# EAGLE design aspirin (EAGLE 6.4)
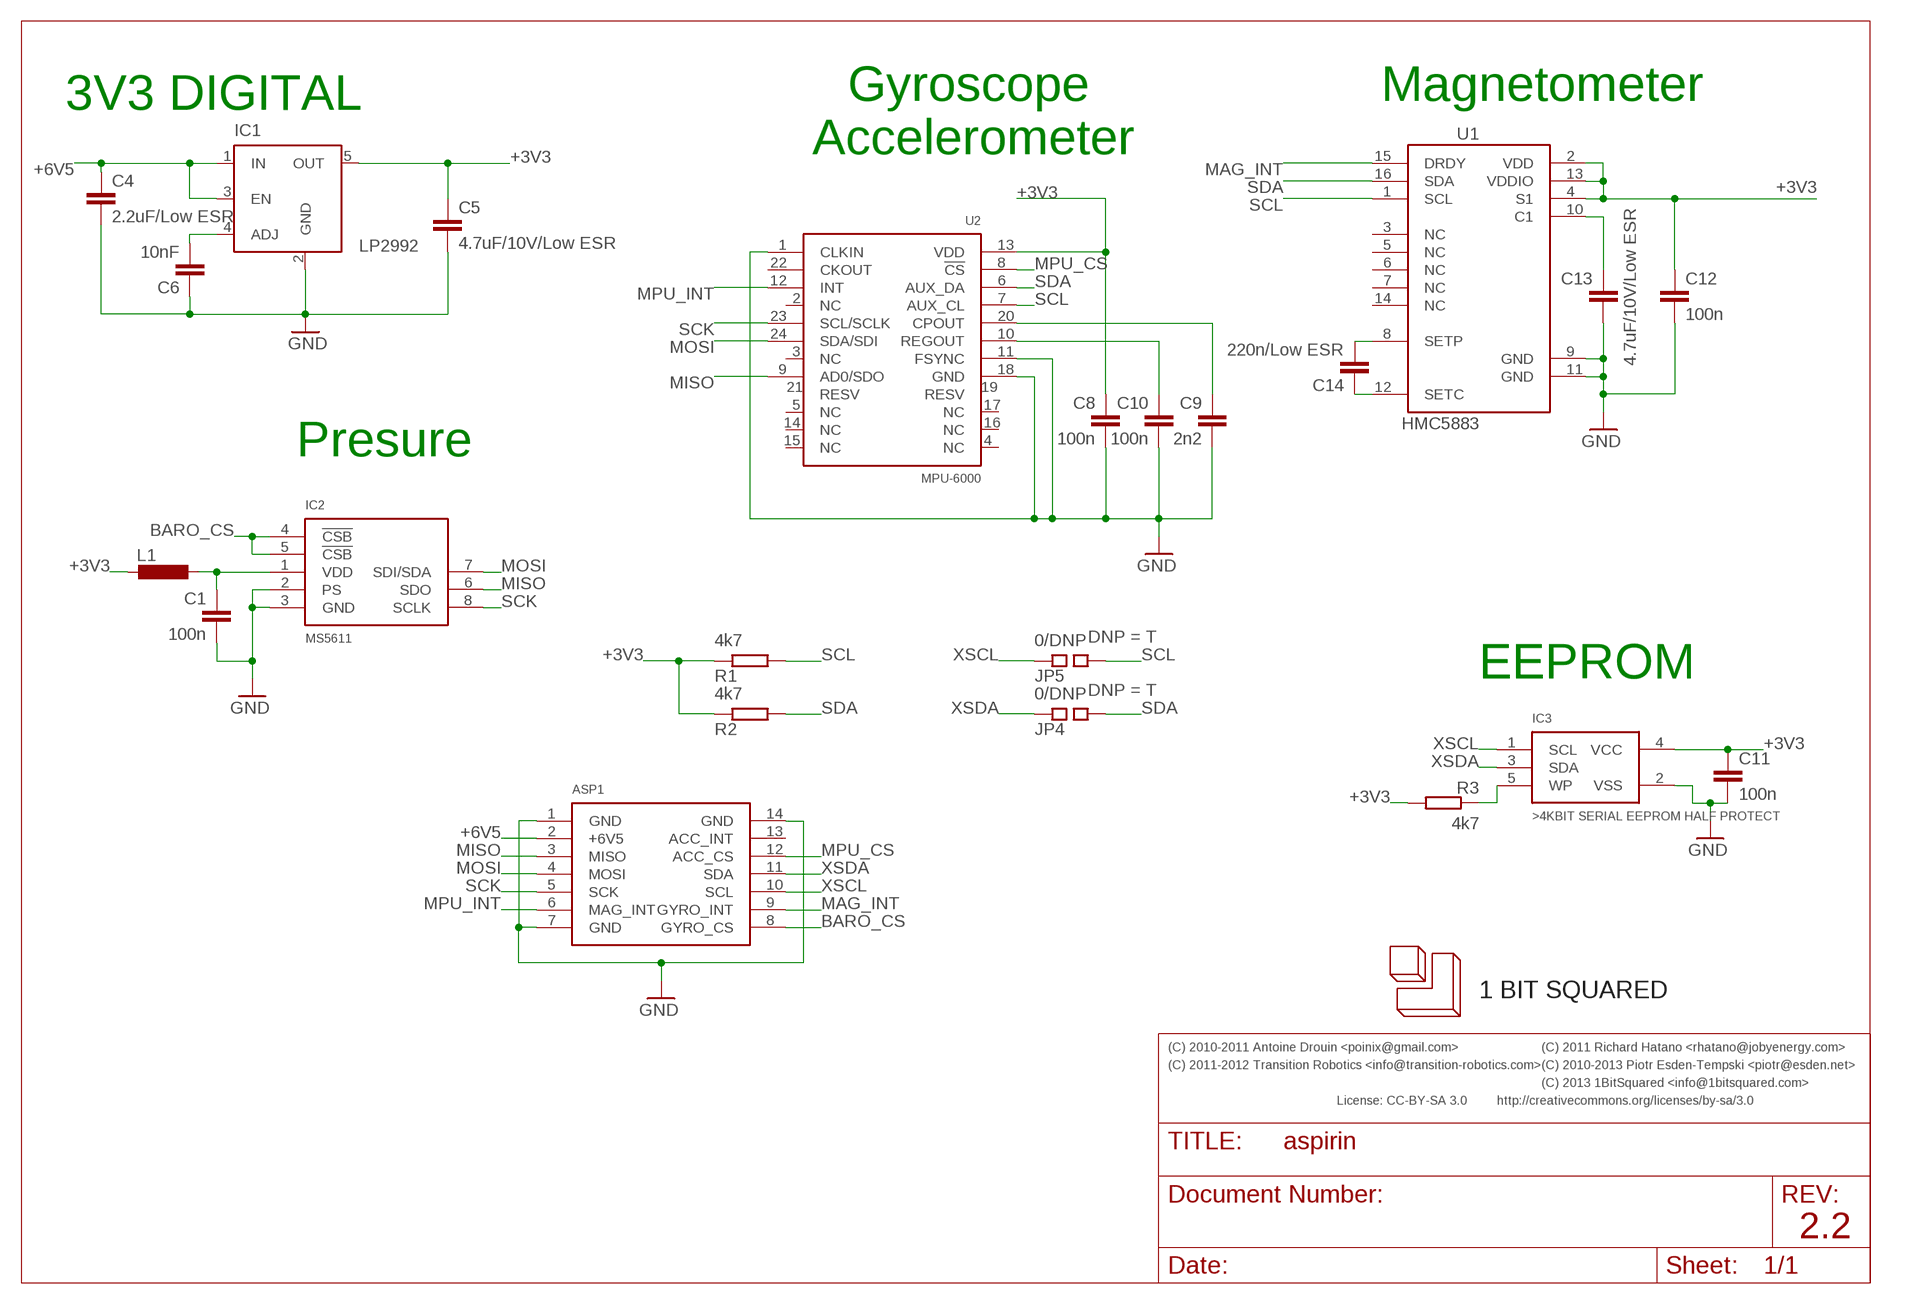
[diagram p0: schematic, sheet 1]

## Parts
ASP1  ASPIRIN  [ASPIRIN_CASTELLATED]
C1  100n  CAPACITOR-0402  [0402-CAP]
C4  2.2uF/Low ESR  CAPACITOR-0603  [0603-CAP]
C5  4.7uF/10V/Low ESR  CAPACITOR-0603  [0603-CAP]
C6  10nF  CAPACITOR-0402  [0402-CAP]
C8  100n  CAPACITOR-0402  [0402-CAP]
C9  2n2  CAPACITOR-0402  [0402-CAP]
C10  100n  CAPACITOR-0402  [0402-CAP]
C11  100n  CAPACITOR-0402  [0402-CAP]
C12  100n  CAPACITOR-0402  [0402-CAP]
C13  4.7uF/10V/Low ESR  CAPACITOR-0603  [0603-CAP]
C14  220n/Low ESR  CAPACITOR-0603  [0603-CAP]
IC1  LP2992  MIC5219BM5  [SOT23-5]
IC2  MS5611  [QFN-MS5611]
IC3  >4KBIT SERIAL EEPROM HALF PROTECT  I2C_EEPROM-SOT23-5  [SOT23-5]
JP4  0/DNP  SQ_JMP-0402  [0402-SQJMP]
JP5  0/DNP  SQ_JMP-0402  [0402-SQJMP]
L1  INDUCTOR-0603  [0603-IND]
R1  4k7  RESISTOR-0402  [0402-RES]
R2  4k7  RESISTOR-0402  [0402-RES]
R3  4k7  RESISTOR-0402  [0402-RES]
U1  HMC5883  [PLCC16-HMC5883]
U2  MPU-6000  [QFN24-NO-PAD]
U$2  1B2-NEW-LOGO-3MM  [1B2-NEW-LOGO-3MM]

## Nets
+3V3: C5.P$1 C8.P$1 C11.P$1 C12.P$1 IC1.5(OUT) IC3.4(VCC) L1.P$2 R1.P$1 R2.P$1 R3.P$2 U1.2(VDD) U1.4(S1) U1.13(VDDIO) U2.13(VDD)
+6V5: ASP1.2(+6V5) C4.P$1 IC1.1(IN) IC1.3(EN)
BARO_+3V3: C1.P$1 IC2.1(VDD) L1.P$1
BARO_CS: ASP1.8(GYRO_CS) IC2.4(!CSB) IC2.5(!CSB)
GND: ASP1.1(GND) ASP1.7(GND) ASP1.14(GND) C1.P$2 C4.P$2 C5.P$2 C6.P$1 C8.P$2 C9.P$2 C10.P$2 C11.P$2 C12.P$2 C13.P$2 IC1.2(GND) IC2.2(PS) IC2.3(GND) IC3.2(VSS) U1.9(GND) U1.11(GND) U2.1(CLKIN) U2.11(FSYNC) U2.18(GND)
MAG_INT: ASP1.9(GYRO_INT) U1.15(DRDY)
MISO: ASP1.3(MISO) IC2.6(SDO) U2.9(AD0/SDO)
MOSI: ASP1.4(MOSI) IC2.7(SDI/SDA) U2.24(SDA/SDI)
MPU_CS: ASP1.12(ACC_CS) U2.8(!CS)
MPU_INT: ASP1.6(MAG_INT) U2.12(INT)
N$1: C9.P$1 U2.20(CPOUT)
N$2: C10.P$1 U2.10(REGOUT)
N$3: C13.P$1 U1.10(C1)
N$4: IC3.5(WP) R3.P$1
N$19: C6.P$2 IC1.4(ADJ)
N$34: C14.P$2 U1.8(SETP)
N$48: C14.P$1 U1.12(SETC)
SCK: ASP1.5(SCK) IC2.8(SCLK) U2.23(SCL/SCLK)
SCL: JP5.P$2 R1.P$2 U1.1(SCL) U2.7(AUX_CL)
SDA: JP4.P$2 R2.P$2 U1.16(SDA) U2.6(AUX_DA)
XSCL: ASP1.10(SCL) IC3.1(SCL) JP5.P$1
XSDA: ASP1.11(SDA) IC3.3(SDA) JP4.P$1
Unconnected: ASP1.13(ACC_INT) U1.3(NC) U1.5(NC) U1.6(NC) U1.7(NC) U1.14(NC) U2.2(NC) U2.3(NC) U2.4(NC) U2.5(NC) U2.14(NC) U2.15(NC) U2.16(NC) U2.17(NC) U2.19(RESV) U2.21(RESV) U2.22(CKOUT)

## Notes on the sheet
- 3V3 DIGITAL | Gyroscope | Magnetometer
- Accelerometer
- Presure
- EEPROM
- 1 BIT SQUARED
- (C) 2010-2011 Antoine Drouin <poinix@gmail.com> | (C) 2011 Richard Hatano <rhatano@jobyenergy.com>
- (C) 2011-2012 Transition Robotics <info@transition-robotics.com> | (C) 2010-2013 Piotr Esden-Tempski <piotr@esden.net>
- (C) 2013 1BitSquared <info@1bitsquared.com>
- License: CC-BY-SA 3.0 | http://creativecommons.org/licenses/by-sa/3.0
- 2.2

## Library data of the parts
ASP1 = aspirin:ASPIRIN; PARTNO: pcb-aspirin
C1 C8 C10-C12 = pel_dipol_comp:CAPACITOR; PARTNO: cap-cer-0402-100n
C4 = pel_dipol_comp:CAPACITOR; PARTNO: cap-cer-0603-2u2
C5 C13 = pel_dipol_comp:CAPACITOR; PARTNO: cap-cer-0603-4u7
C6 = pel_dipol_comp:CAPACITOR; PARTNO: cap-cer-0402-10n
C9 = pel_dipol_comp:CAPACITOR; PARTNO: cap-cer-0402-2n2
C14 = pel_dipol_comp:CAPACITOR; PARTNO: cap-cer-0603-220n
IC1 = v-reg-micrel:MIC5219BM5: VOLTAGE REGULATOR; PARTNO: vreg-sot-23-5-3v3
IC2 = aspirin:MS5611; PARTNO: sensr-qfn-8-baro
IC3 = aspirin:I2C_EEPROM; PARTNO: ic-sot-23-5-4k-eeprom
JP4 JP5 = pel_jumpers:SQ_JMP; DNP: T; PARTNO: res-0402-0
L1 = res_cap:INDUCTOR; PARTNO: ferrite-0603-600ohm
R1-R3 = pel_dipol_comp:RESISTOR; PARTNO: res-0402-4k7
U1 = aspirin:HMC5883; PARTNO: sensr-plcc-16-mag
U2 = aspirin:MPU-6000; PARTNO: sensr-qfn-24-acc-gyro
U$2 = 1b2:1B2-NEW-LOGO; BOM: EXCLUDE

## Board
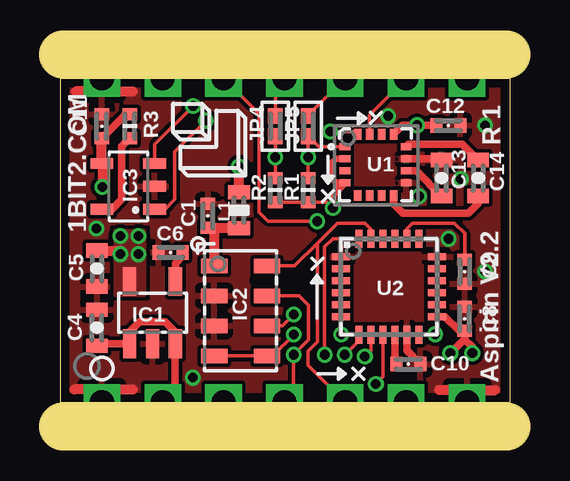
[diagram p1: board, top side]
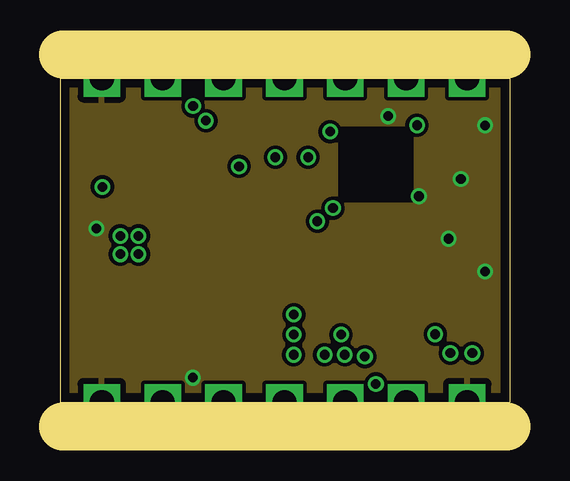
[diagram p2: board, inner layer Route2]
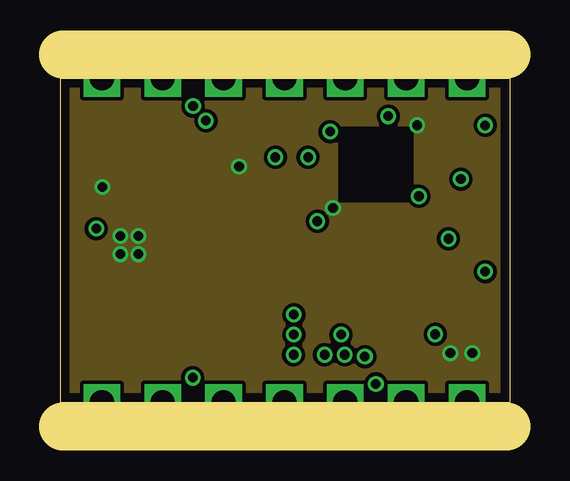
[diagram p3: board, inner layer Route15]
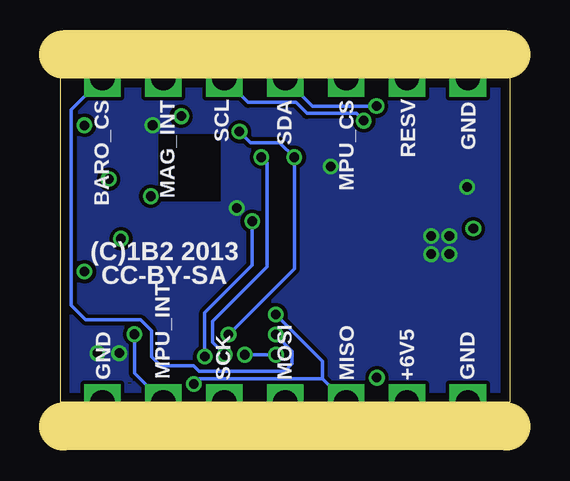
[diagram p4: board, bottom side, seen from below]

Size 18.75 x 13.5 mm. Coordinates in mm from the lower left corner, seen from the top.
Outline: 0,13.5 0,0 18.75,0 18.75,13.5 0,13.5
Copper layers (1*2+15*16): Top 0.035mm / dielectric 0.2mm / Route2 0.035mm / dielectric 1.5mm / Route15 0.035mm / dielectric 0.2mm / Bottom 0.035mm
Design rules "default": minimum track width 0.15mm, minimum drill 0.4mm, track to track 6mil, track to pad 6mil, pad to pad 6mil, via to via 6mil, smd to smd 6mil, copper to edge 15mil, drill to drill 8mil, minimum pad ring 5mil, minimum via ring 5mil, stop-mask expansion 4mil, vias tented up to drill 0.4mm, thermal gap 10mil
tRestrict: area 16.1,2.5 to 16.3,2.6; area 7.9,5 to 8,5.2; area 14,10.1 to 14.1,10.2; area 14,9.1 to 14.1,9.2
bRestrict: area 15.8,0.8 to 15.9,0.8; area 12.1,8.4 to 14.6,11.2
Milling: 2 lines

### Footprints (pad centres in the part's own frame; a part is rotated, then mirrored left to right if it is on the bottom)
ASPIRIN_CASTELLATED = drill 1.016 square: 1 0,0; 2 2.54,0; 3 5.08,0; 4 7.62,0; 5 10.16,0; 6 12.7,0; 7 15.24,0; 8 15.24,13.5; 9 12.7,13.5; 10 10.16,13.5; 11 7.62,13.5; 12 5.08,13.5; 13 2.54,13.5; 14 0,13.5
0402-CAP = smd 0.5 x 0.6: P$1 -0.5,0; P$2 0.5,0
0603-CAP = smd 0.6 x 0.9: P$1 -0.75,0; P$2 0.75,0
SOT23-5 = smd 0.55 x 1.2: 1 -0.95,-1.3; 2 0,-1.3; 3 0.95,-1.3; 4 0.95,1.3; 5 -0.95,1.3
QFN-MS5611 = smd 1.1 x 0.6: 1 -1.1,1.875; 2 -1.1,0.625; 3 -1.1,-0.625; 4 -1.1,-1.875; 5 1.1,-1.875; 6 1.1,-0.625; 7 1.1,0.625; 8 1.1,1.875
SOT23-5' = smd 0.45 x 0.95: 1 0.95,1.1; 2 0,1.1; 3 -0.95,1.1; 4 -0.95,-1.1; 5 0.95,-1.1
0402-SQJMP = smd 0.652 x 0.6: P$1 -0.424,0; P$2 0.424,0
0603-IND = smd 0.6 x 0.9: P$1 -0.75,0; P$2 0.75,0
0402-RES = smd 0.5 x 0.6: P$1 -0.5,0; P$2 0.5,0
PLCC16-HMC5883 = smd 0.45 x 0.3: 1 -1.275,0.75; 2 -1.275,0.25; 3 -1.275,-0.25; 4 -1.275,-0.75; 9 1.275,-0.75; 10 1.275,-0.25; 11 1.275,0.25; 12 1.275,0.75 | smd 0.3 x 0.45: 5 -0.75,-1.275; 6 -0.25,-1.275; 7 0.25,-1.275; 8 0.75,-1.275; 13 0.75,1.275; 14 0.25,1.275; 15 -0.25,1.275; 16 -0.75,1.275
QFN24-NO-PAD = smd 0.75 x 0.3: 1 -2,1.25; 2 -2,0.75; 3 -2,0.25; 4 -2,-0.25; 5 -2,-0.75; 6 -2,-1.25; 13 2,-1.25; 14 2,-0.75; 15 2,-0.25; 16 2,0.25; 17 2,0.75; 18 2,1.25 | smd 0.3 x 0.75: 7 -1.25,-2; 8 -0.75,-2; 9 -0.25,-2; 10 0.25,-2; 11 0.75,-2; 12 1.25,-2; 19 1.25,2; 20 0.75,2; 21 0.25,2; 22 -0.25,2; 23 -0.75,2; 24 -1.25,2

### Placement (x,y rotation side)
ASP1  1.74,0 0 top
C1  6.17,7.76 90 top
C4  1.54,3.11 90 top
C5  1.54,5.57 270 top
C6  4.62,6.25 0 top
C8  16.88,3.48 90 top
C9  16.88,5.43 270 top
C10  14.54,1.59 0 top
C11  1.74,11.51 90 top
C12  16.19,11.53 0 top
C13  15.92,9.34 90 top
C14  17.44,9.34 270 top
IC1  3.86,3.73 0 top
IC2  7.53,3.81 0 top
IC3  >4KBIT SERIAL EEPROM HALF PROTECT  [SOT23-5']  2.85,9 270 top
JP4  8.98,11.51 270 top
JP5  10.35,11.51 270 top
L1  7.47,8 90 top
R1  10.35,8.84 90 top
R2  8.98,8.84 90 top
R3  2.91,11.51 90 top
U1  13.16,9.89 0 top
U2  13.72,4.82 0 top
U$2  4.72,9.45 0 top

### Tracks (layer width: path | path; a pad name or v marks a point on that pad's centre or on a via)
+3V3  (via drill 0.4)
  Top 0.152: v11.38,8.09 11.13,8.34 R1.P$1 R2.P$1
  Top 0.279: U1.2 11.51,10.14 11.28,9.92 11.28,9.38 11.53,9.14 U1.4
  Top 0.305: U2.13 16.06,3.56 16.65,2.98 C8.P$1 16.88,2.64 v16.28,2.05 | U1.4 11.38,8.64 v11.38,8.09 | U1.13 14.29,11.54 v14.89,11.54 v14.9,11.53 C12.P$1 | R3.P$2 2.74,12.01 C11.P$1 | v17.2,2.05 17.2,2.31 16.92,2.59
  Top 0.406: v1.77,8.97 1.77,9.93 IC3.4 C11.P$1 | C5.P$1 2.52,6.32 v2.52,6.17 | L1.P$2 v7.47,9.83
  other vias: 3.28,6.17 2.51,6.93 3.28,6.93
  pour Top (no thermals): 3.52,4.46 2.3,4.46 2.3,7.16 3.52,7.16
  pour Bottom (rank 6): 0,0 18.75,0 18.75,13.5 0,13.5
  pour Route15 (rank 6): 0,0 18.75,0 18.75,13.5 0,13.5
+6V5
  Top 0.305: ASP1.2 4.81,0.53 IC1.3 4.81,2.94 4.39,3.35 3.33,3.35 2.91,2.94 IC1.1 1.54,2.43 C4.P$1
BARO_+3V3
  Top 0.406: L1.P$1 C1.P$1 6.43,7.26 IC2.1
BARO_CS  (via drill 0.4)
  Top 0.152: IC2.4 IC2.5 8.87,1.94 v9.75,2.82
  Bottom 0.152: v9.75,2.82 9.07,2.13 9.07,1.6 9.37,1.29 12.95,1.29 13.18,1.52 14.55,1.52 14.94,1.91 14.94,2.97 15.39,3.43 17.68,3.43 18.29,4.04 18.29,12.2 ASP1.8
GND  (via drill 0.4)
  Top 0.152: ASP1.14 1.74,13.49 | 16.98,-0.03 ASP1.7
  Top 0.305: C13.P$2 15.87,10.14 U1.11 | U2.11 14.47,2.16 C10.P$2
  Top 0.406: 0.6,0.53 1.21,0.53 ASP1.1 2.28,0.53 3.04,0.53 | 3.04,12.95 2.28,12.95 1.74,13.49 1.21,12.95 0.68,12.95 | 18.15,0.51 17.52,0.51 16.98,-0.03 16.45,0.51 15.81,0.51
  other vias: 17.73,5.44 16.72,9.3 14.97,8.59 1.51,7.24 16.21,6.82 17.73,11.54 13.69,11.92 5.54,1.02
  pour Top (rank 6): 0,0 18.75,0 18.75,13.5 0,13.5
  pour Route2 (rank 6): 0,0 18.75,0 18.75,13.5 0,13.5
MAG_INT
  Top 0.152: U1.15 12.91,11.97 ASP1.9
MISO  (via drill 0.4)
  Top 0.152: v13.17,0.76 13.47,1.05 U2.9 | IC2.6 9.28,3.19 v9.75,3.66
  Bottom 0.152: ASP1.3 7.81,0.99 | 7.81,0.99 12.95,0.99 v13.17,0.76 | 7.81,0.99 7.81,1.72 v9.75,3.66
MOSI  (via drill 0.4)
  Top 0.152: ASP1.4 9.74,0.38 v9.74,1.98 10.36,2.6 10.36,4.04 9.97,4.43 IC2.7 | v11.04,1.98 11.04,6.48 11.38,6.82 U2.24
  Bottom 0.152: v9.74,1.98 v11.04,1.98
MPU_CS  (via drill 0.4)
  Top 0.152: v12.72,1.91 12.97,2.15 U2.8 | ASP1.12 8.3,12.03 8.3,7.92 8.68,7.54 v10.73,7.54
  Bottom 0.152: v10.73,7.54 10.73,5.71 12.72,3.73 v12.72,1.91
MPU_INT  (via drill 0.4)
  Top 0.152: U2.12 15.63,2.81 v15.65,2.83
  Bottom 0.152: ASP1.6 15.65,1.2 v15.65,2.83
N$1
  Top 0.152: U2.20 14.47,7.24 14.7,7.47 16.45,7.47 16.88,7.04 C9.P$1
N$2
  Top 0.305: U2.10 13.97,1.66 C10.P$1
N$3
  Top 0.305: C13.P$1 14.87,9.64 U1.10
N$4
  Top 0.305: R3.P$1 2.58,10.68 2.58,8.46 2.17,8.05 IC3.5
N$5
  cutout Route15: 11.66,8.38 14.71,8.38 14.71,11.43 11.66,11.43
  cutout Route2: 11.66,8.38 14.71,8.38 14.71,11.43 11.66,11.43
N$19
  Top 0.305: C6.P$2 5.12,6.1 4.82,5.79 IC1.4
N$34
  Top 0.305: C14.P$2 17.44,8.3 17.02,7.89 14.31,7.89 13.91,8.28 U1.8
N$48
  Top 0.305: C14.P$1 16.79,10.74 14.54,10.74 U1.12
SCK
  Top 0.152: ASP1.5 10.35,1.55 10.35,2.13 10.73,2.52 10.73,6.63 | 10.73,6.63 11.57,7.47 12.72,7.47 12.97,7.22 U2.23 | IC2.8 9.79,5.68 10.73,6.63
SCL  (via drill 0.4)
  Top 0.152: U2.7 12.47,2.57 v11.88,1.98 | R1.P$2 v10.35,10.21 JP5.P$2 10.79,10.64 U1.1
  Bottom 0.152: v10.35,10.21 10.12,9.98 10.12,5.64 12.39,3.37 12.39,2.49 v11.88,1.98
SDA  (via drill 0.4)
  Top 0.152: JP4.P$2 v8.98,10.21 R2.P$2 | v11.73,2.82 11.73,3.56 | U1.16 12.3,11.28 v11.27,11.28
  Top 0.305: 11.73,3.56 U2.6
  Bottom 0.152: v11.73,2.82 8.98,5.56 v8.98,10.21 9.59,10.82 10.81,10.82 v11.27,11.28
XSCL  (via drill 0.4)
  Top 0.152: ASP1.10 10.35,11.95 JP5.P$1 | v6.09,11.73 4.79,10.44 4.79,8.46 4.38,8.05 IC3.1
  Bottom 0.152: ASP1.10 10.9,12.5 8.91,12.5 8.46,12.04 6.39,12.04 v6.09,11.73
XSDA  (via drill 0.4)
  Top 0.152: JP4.P$1 8.98,13.12 ASP1.11 | v5.55,12.34 3.95,10.74 IC3.3
  Bottom 0.152: v5.55,12.34 8.22,12.34 9.36,13.49 ASP1.11

### Text on the board
tPlace: R 1 | 1BIT2.COM | Aspirin V2.2
bPlace: GND | RESV | MPU_CS | SDA | SCL | MAG_INT | BARO_CS | (C)1B2 2013 | CC-BY-SA | GND | +6V5 | MISO | MOSI | SCK | MPU_INT | GND
Reference: (C) 2010-2011 Antoine Drouin <poinix@gmail.com> | Licensed under: | (C) 2010-2013 Piotr Esden-Tempski <piotr@esden.net> | (C) 2011 Richard Hatano <rhatano@jobyenergy.com> | CC-BY-SA 3.0 | (C) 2011-2012 Transition Robotics <info@transition-robotics.com> | (C) 2013 1BitSquared <info@1bitsquared.com> | http://creativecommons.org/licenses/by-sa/3.0/